# EAGLE schematic buck (EAGLE 9.6.2)
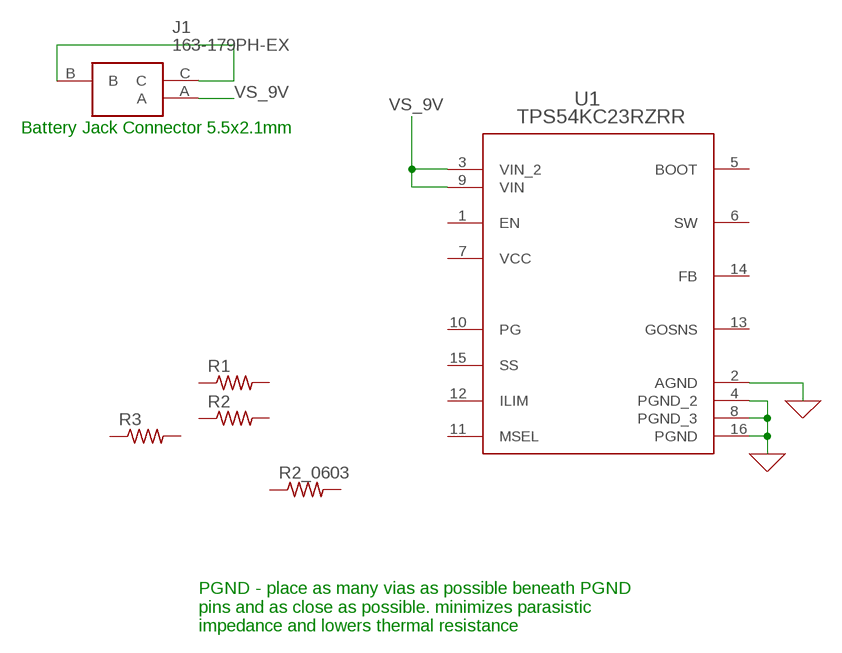
[diagram p0: schematic, sheet 1]

## Parts
J1  163-179PH-EX  [163179PHEX]
R1  R-US_R0603  [R0603]
R2  R-US_R0603  [R0603]
R2_0603  R-US_R0603  [R0603]
R3  R-US_R0603  [R0603]
U1  TPS54KC23RZRR  [RZR0016A-MFG]

## Nets
0: U1.2(AGND) U1.4(PGND_2) U1.8(PGND_3) U1.16(PGND) ; supply symbol labelled GND
N$2: J1.B J1.C
VS_9V: J1.A U1.3(VIN_2) U1.9(VIN)
Unconnected: R1.1 R1.2 R2.1 R2.2 R2_0603.1 R2_0603.2 R3.1 R3.2 U1.1(EN) U1.5(BOOT) U1.6(SW) U1.10(PG) U1.11(MSEL) U1.12(ILIM) U1.13(GOSNS) U1.14(FB) U1.15(SS)

## Notes on the sheet
- Battery Jack Connector 5.5x2.1mm
- PGND - place as many vias as possible beneath PGND
  pins and as close as possible. minimizes parasistic
  impedance and lowers thermal resistance

## Power pins joined to a net without a drawn wire
VCC: U1.7(VCC)

## Library data of the parts
J1 = 163-179PH-EX:163-179PH-EX: DC Power Connectors PCB 2.1MM Source: Datasheet <https://componentsearchengine.com/Datasheets/1/163-179PH-EX.pdf>; DESCRIPTION: DC Power Connectors PCB 2.1MM; HEIGHT: 11mm; MANUFACTURER_NAME: Kobiconn; MANUFACTURER_PART_NUMBER: 163-179PH-EX; MOUSER_PART_NUMBER: 163-179PH-EX; MOUSER_PRICE-STOCK: https://www.mouser.co.uk/ProductDetail/Kobiconn/163-179PH-EX?qs=Xb8IjHhkxj5l2UOaIqcGCw%3D%3D
R1 R2 R2_0603 R3 = rcl:R-US_: RESISTOR, American symbol; SPICEPREFIX: R
U1 = TPS54KC23:TPS54KC23RZRR; COPYRIGHT: Copyright (C) 2024 Ultra Librarian. All rights reserved.; MANUFACTURER_PART_NUMBER: TPS54KC23RZRR; MFR_NAME: Texas Instruments; REFDES: RefDes; TYPE: TYPE